# Altium schematic sheet Camera.SchDoc
size A
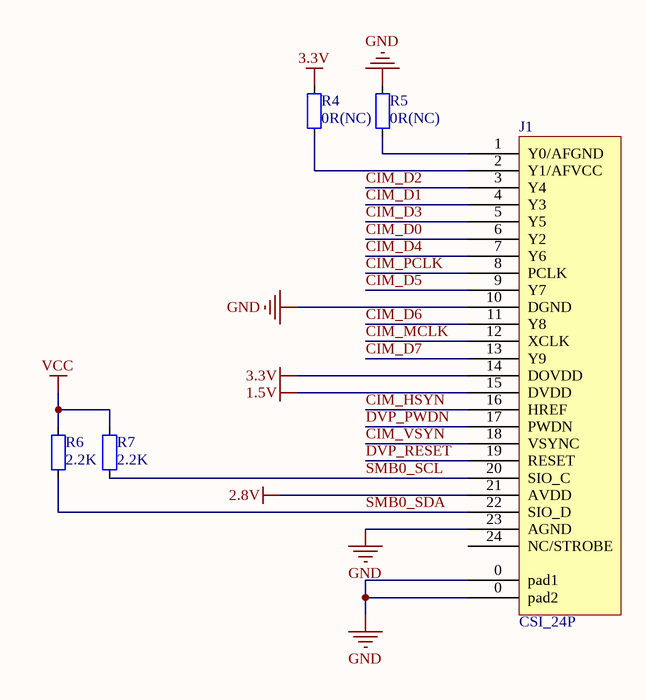
[diagram p0: Camera.SchDoc]

## Parts
J1  CSI_24P  [FFC_0.5_24]
R4  value 0R(NC)  [RES_0402]  (hidden comment: Res_0402)
R5  value 0R(NC)  [RES_0402]  (hidden comment: Res_0402)
R6  value 2.2K  [RES_0402]  (hidden comment: Res_0402)
R7  value 2.2K  [RES_0402]  (hidden comment: Res_0402)

## Nets
1.5V: J1.15(DVDD)
2.8V: J1.21(AVDD)
3.3V: J1.14(DOVDD) R4.2
GND: J1.0(pad1) J1.10(DGND) J1.23(AGND) R5.2
VCC: R6.2 R7.2
CIM_D0: J1.6(Y2)
CIM_D1: J1.4(Y3)
CIM_D2: J1.3(Y4)
CIM_D3: J1.5(Y5)
CIM_D4: J1.7(Y6)
CIM_D5: J1.9(Y7)
CIM_D6: J1.11(Y8)
CIM_D7: J1.13(Y9)
CIM_HSYN: J1.16(HREF)
CIM_MCLK: J1.12(XCLK)
CIM_PCLK: J1.8(PCLK)
CIM_VSYN: J1.18(VSYNC)
DVP_PWDN: J1.17(PWDN)
DVP_RESET: J1.19(RESET)
SMB0_SCL: J1.20(SIO_C) R7.1
SMB0_SDA: J1.22(SIO_D) R6.1
NetJ1_1: J1.1(Y0/AFGND) R5.1
NetJ1_2: J1.2(Y1/AFVCC) R4.1

Not connected (* = marked no-connect by the designer): J1 24(NC/STROBE)

## Library data of the parts
R4-R7 = Res_0402: Resistor